# EAGLE schematic LED Cube with Rs (EAGLE 6.0)
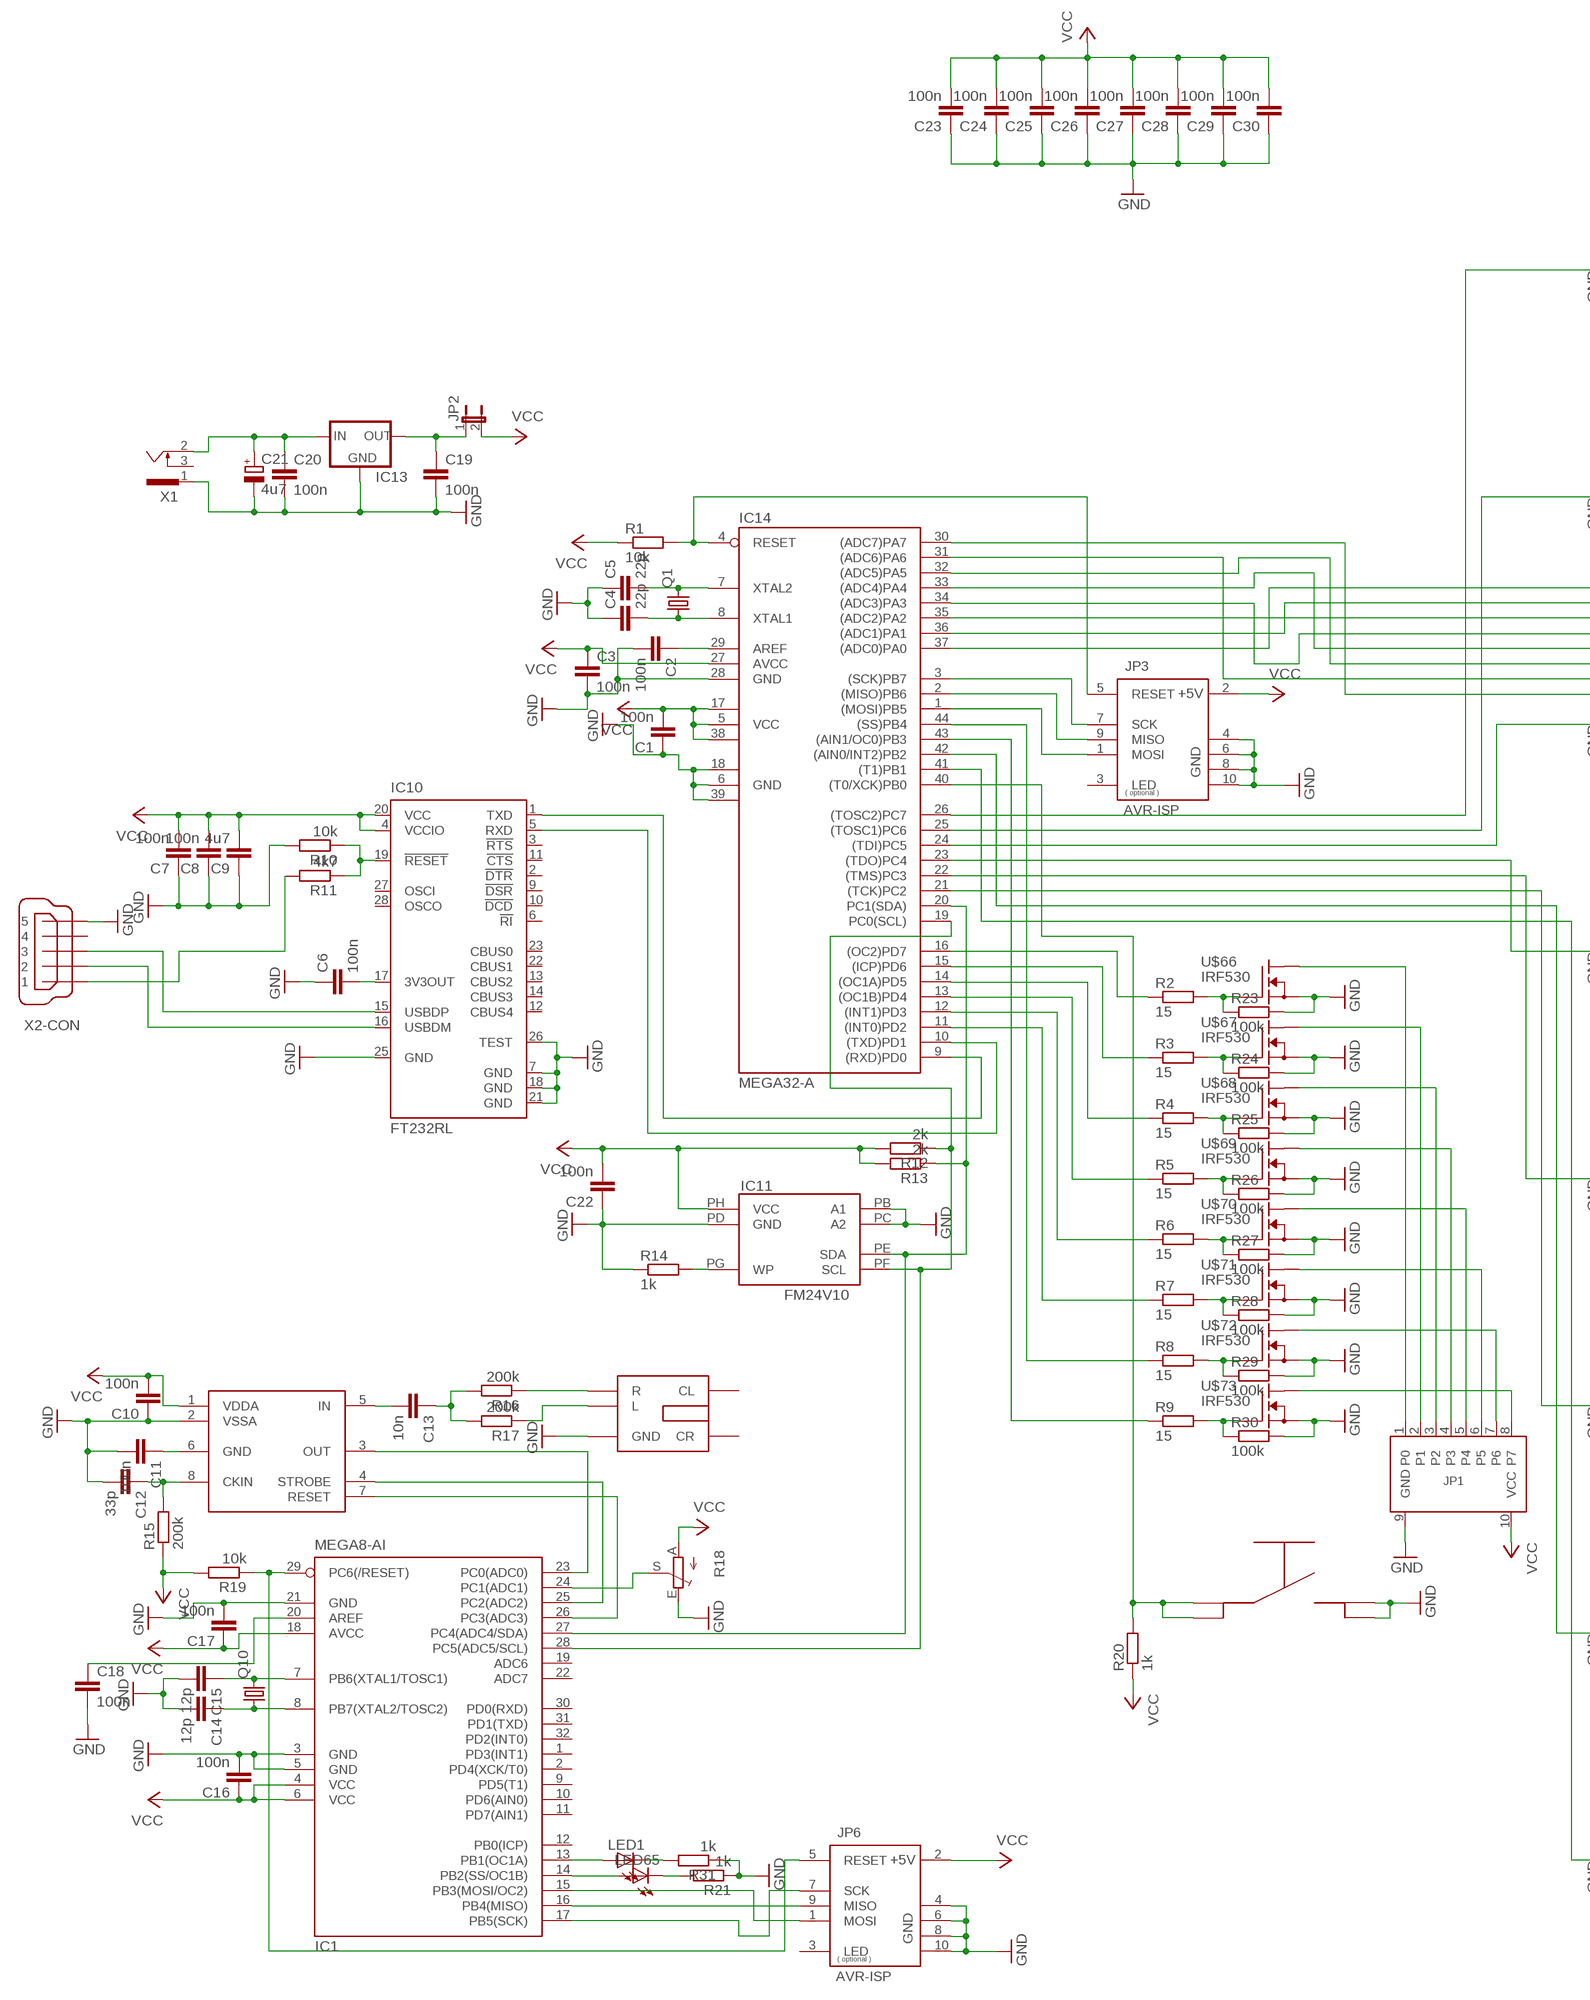
[diagram p0: schematic, sheet 1, part 1 of 2]
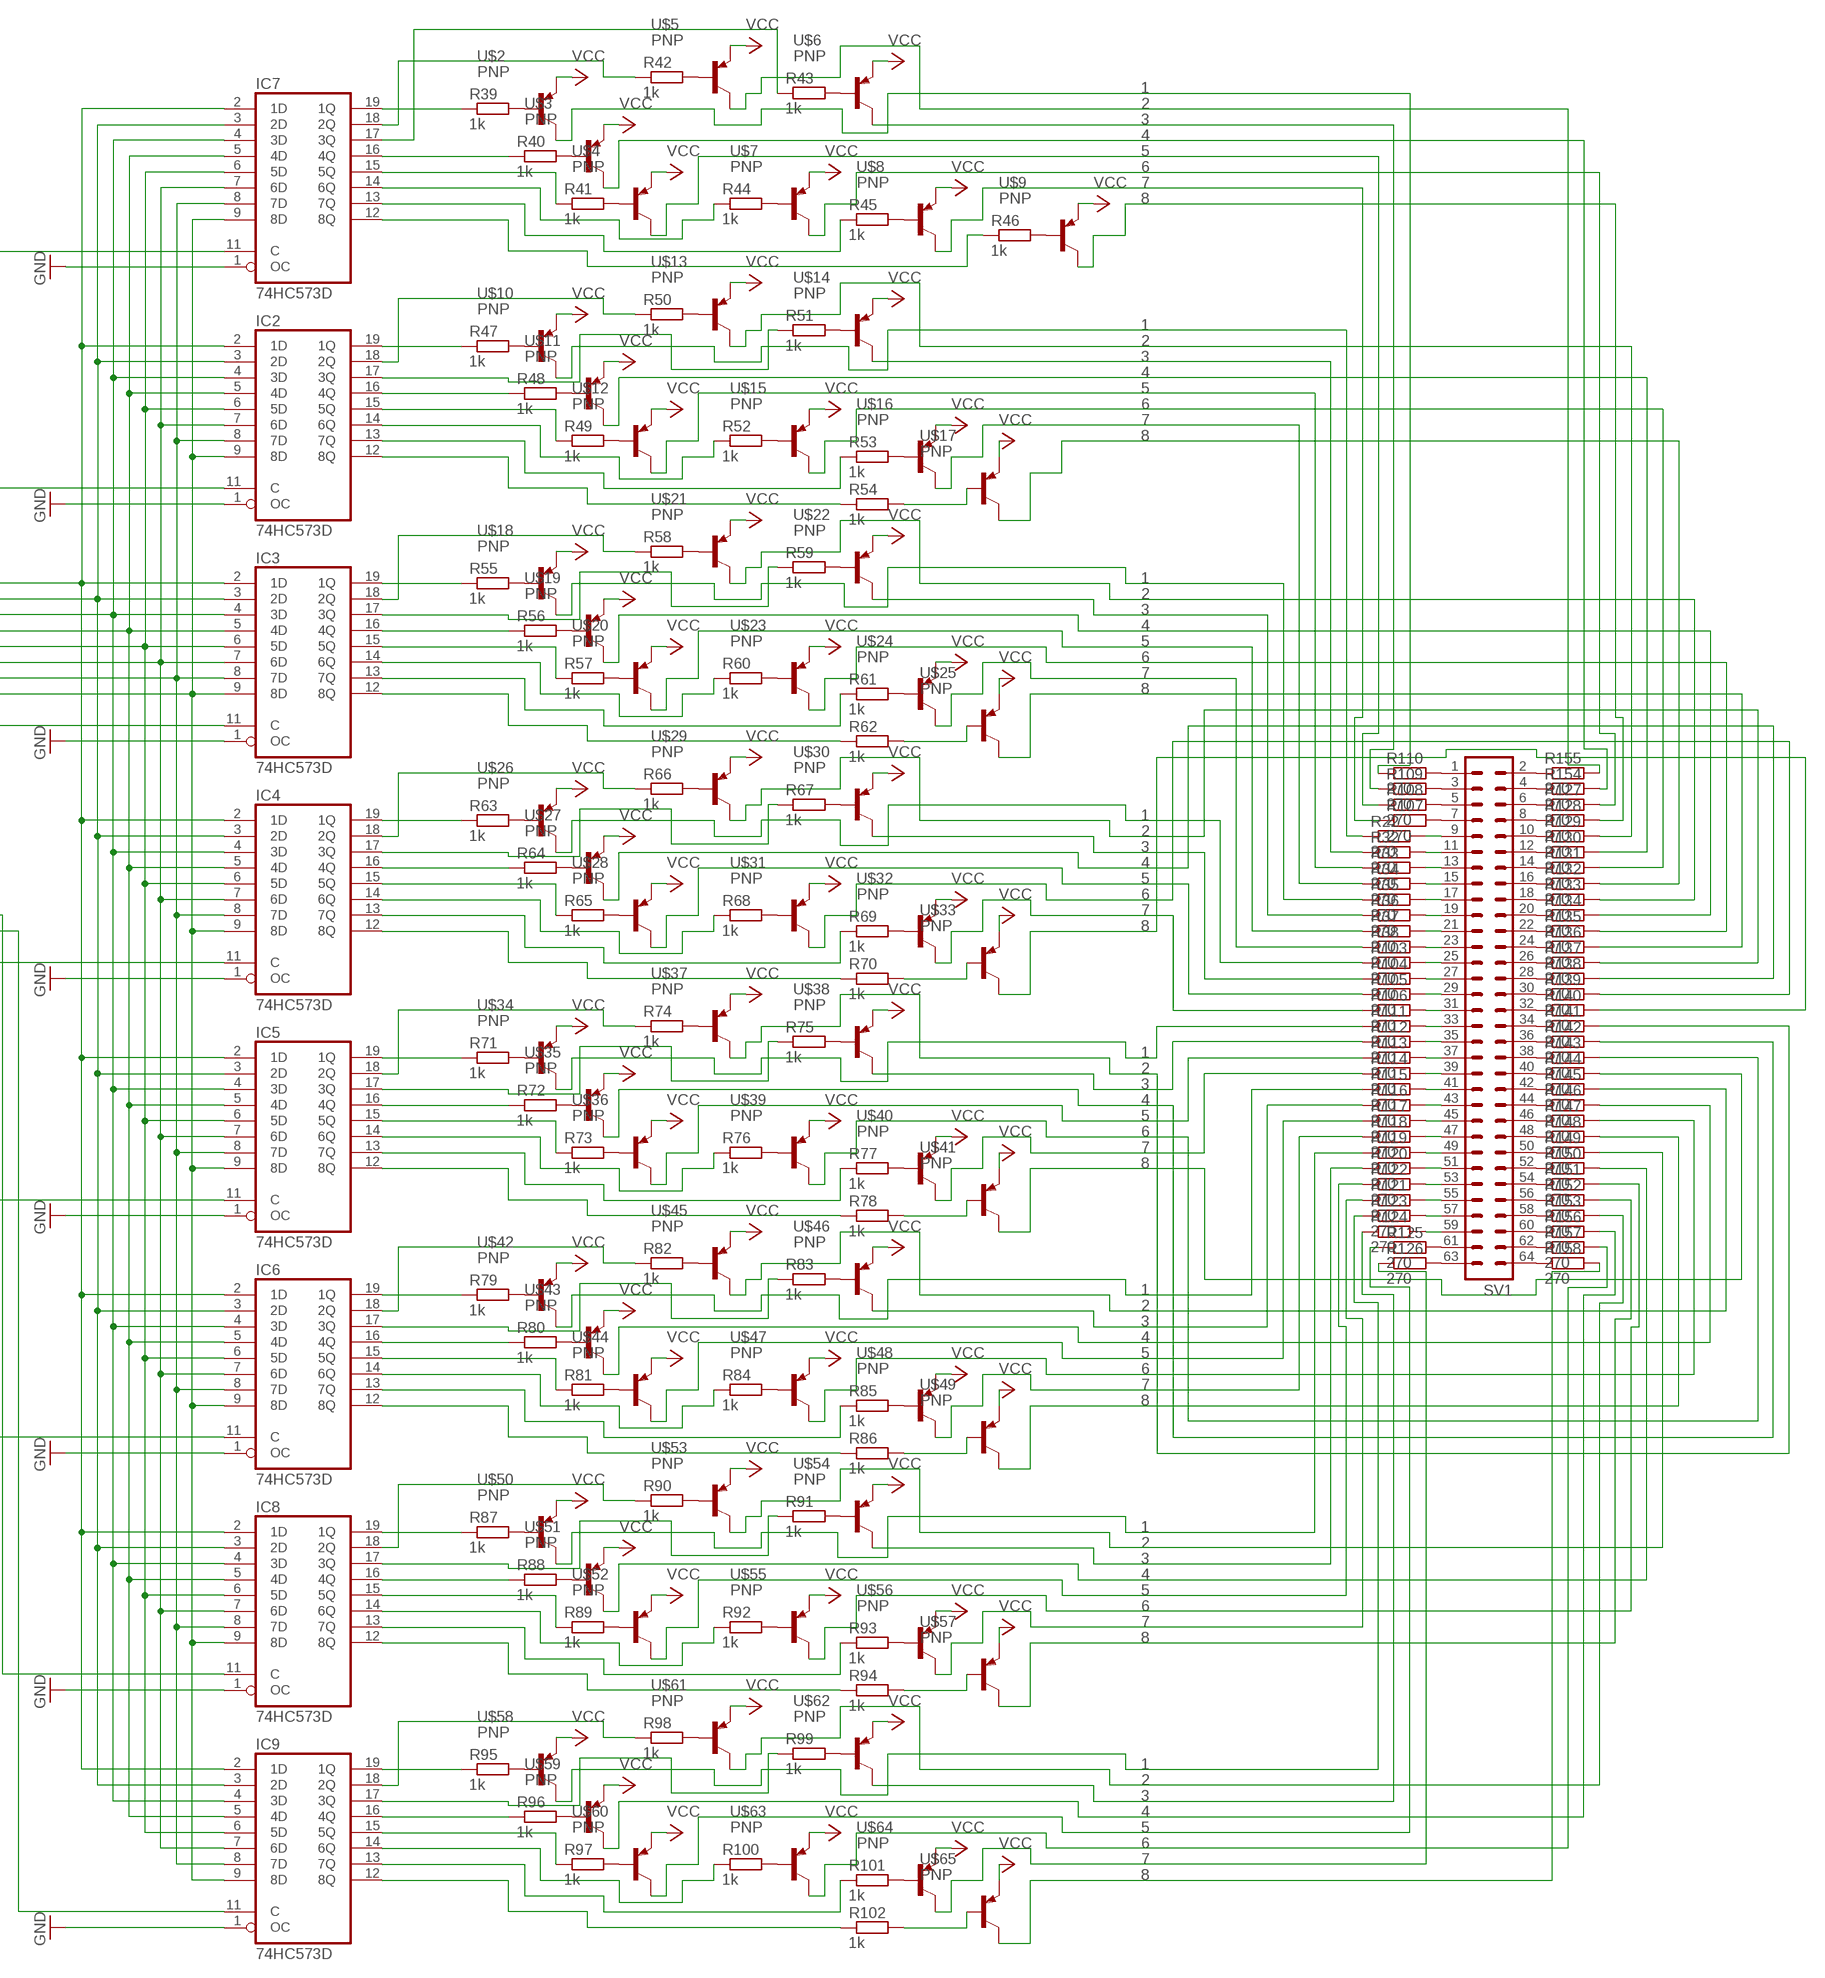
[diagram p1: schematic, sheet 1, part 2 of 2]

## Parts
C1  100n  C-EUC0603  [C0603]
C2  100n  C-EUC0603  [C0603]
C3  100n  C-EUC0603  [C0603]
C4  22p  C-EUC0603  [C0603]
C5  22p  C-EUC0603  [C0603]
C6  100n  C-EUC0603  [C0603]
C7  100n  C-EUC0603  [C0603]
C8  100n  C-EUC0603  [C0603]
C9  4u7  C-EUC0603  [C0603]
C10  100n  C-EUC0603  [C0603]
C11  100n  C-EUC0603  [C0603]
C12  33p  C-EUC0603  [C0603]
C13  10n  C-EUC0603  [C0603]
C14  12p  C-EUC0603  [C0603]
C15  12p  C-EUC0603  [C0603]
C16  100n  C-EUC0603  [C0603]
C17  100n  C-EUC0603  [C0603]
C18  100n  C-EUC0603  [C0603]
C19  100n  C-EUC0603  [C0603]
C20  100n  C-EUC0603  [C0603]
C21  4u7  CPOL-EUTAP5-80  [TAP5-80]
C22  100n  C-EUC0603  [C0603]
C23  100n  C-EUC0603  [C0603]
C24  100n  C-EUC0603  [C0603]
C25  100n  C-EUC0603  [C0603]
C26  100n  C-EUC0603  [C0603]
C27  100n  C-EUC0603  [C0603]
C28  100n  C-EUC0603  [C0603]
C29  100n  C-EUC0603  [C0603]
C30  100n  C-EUC0603  [C0603]
IC1  MEGA8-AI  [TQFP32-08]
IC2  74HC573D  [SO20W]
IC3  74HC573D  [SO20W]
IC4  74HC573D  [SO20W]
IC5  74HC573D  [SO20W]
IC6  74HC573D  [SO20W]
IC7  74HC573D  [SO20W]
IC8  74HC573D  [SO20W]
IC9  74HC573D  [SO20W]
IC10  FT232RL  [SSOP28]
IC11  FM24V10  [SOIC8]
IC12  MSGEQ7  [DIP8]
IC13  78XXS  [78XXS]
IC14  MEGA32-A  [TQFP44]
JP1  PORT  [ML10]
JP2  JP1E  [JP1]
JP3  AVR-ISP  [ML10]
JP6  AVR-ISP  [ML10]
LED1  LEDCHIPLED_0603  [CHIPLED_0603]
LED65  LEDCHIPLED_0603  [CHIPLED_0603]
Q1  CRYSTALHC49S  [HC49/S]
Q10  CRYSTALHC49S  [HC49/S]
R1  10k  R-EU_R0603  [R0603]
R2  15  R-EU_R0603  [R0603]
R3  15  R-EU_R0603  [R0603]
R4  15  R-EU_R0603  [R0603]
R5  15  R-EU_R0603  [R0603]
R6  15  R-EU_R0603  [R0603]
R7  15  R-EU_R0603  [R0603]
R8  15  R-EU_R0603  [R0603]
R9  15  R-EU_R0603  [R0603]
R10  10k  R-EU_R0603  [R0603]
R11  4k7  R-EU_R0603  [R0603]
R12  2k  R-EU_R0603  [R0603]
R13  2k  R-EU_R0603  [R0603]
R14  1k  R-EU_R0603  [R0603]
R15  200k  R-EU_R0603  [R0603]
R16  200k  R-EU_R0603  [R0603]
R17  200k  R-EU_R0603  [R0603]
R18  TRIM_EU-PT10S  [PT-10S]
R19  10k  R-EU_R0603  [R0603]
R20  1k  R-EU_R0603  [R0603]
R21  1k  R-EU_R0603  [R0603]
R22  270  R-EU_R0603  [R0603]
R23  100k  R-EU_R0603  [R0603]
R24  100k  R-EU_R0603  [R0603]
R25  100k  R-EU_R0603  [R0603]
R26  100k  R-EU_R0603  [R0603]
R27  100k  R-EU_R0603  [R0603]
R28  100k  R-EU_R0603  [R0603]
R29  100k  R-EU_R0603  [R0603]
R30  100k  R-EU_R0603  [R0603]
R31  1k  R-EU_R0603  [R0603]
R32  270  R-EU_R0603  [R0603]
R33  270  R-EU_R0603  [R0603]
R34  270  R-EU_R0603  [R0603]
R35  270  R-EU_R0603  [R0603]
R36  270  R-EU_R0603  [R0603]
R37  270  R-EU_R0603  [R0603]
R38  270  R-EU_R0603  [R0603]
R39  1k  R-EU_R0603  [R0603]
R40  1k  R-EU_R0603  [R0603]
R41  1k  R-EU_R0603  [R0603]
R42  1k  R-EU_R0603  [R0603]
R43  1k  R-EU_R0603  [R0603]
R44  1k  R-EU_R0603  [R0603]
R45  1k  R-EU_R0603  [R0603]
R46  1k  R-EU_R0603  [R0603]
R47  1k  R-EU_R0603  [R0603]
R48  1k  R-EU_R0603  [R0603]
R49  1k  R-EU_R0603  [R0603]
R50  1k  R-EU_R0603  [R0603]
R51  1k  R-EU_R0603  [R0603]
R52  1k  R-EU_R0603  [R0603]
R53  1k  R-EU_R0603  [R0603]
R54  1k  R-EU_R0603  [R0603]
R55  1k  R-EU_R0603  [R0603]
R56  1k  R-EU_R0603  [R0603]
R57  1k  R-EU_R0603  [R0603]
R58  1k  R-EU_R0603  [R0603]
R59  1k  R-EU_R0603  [R0603]
R60  1k  R-EU_R0603  [R0603]
R61  1k  R-EU_R0603  [R0603]
R62  1k  R-EU_R0603  [R0603]
R63  1k  R-EU_R0603  [R0603]
R64  1k  R-EU_R0603  [R0603]
R65  1k  R-EU_R0603  [R0603]
R66  1k  R-EU_R0603  [R0603]
R67  1k  R-EU_R0603  [R0603]
R68  1k  R-EU_R0603  [R0603]
R69  1k  R-EU_R0603  [R0603]
R70  1k  R-EU_R0603  [R0603]
R71  1k  R-EU_R0603  [R0603]
R72  1k  R-EU_R0603  [R0603]
R73  1k  R-EU_R0603  [R0603]
R74  1k  R-EU_R0603  [R0603]
R75  1k  R-EU_R0603  [R0603]
R76  1k  R-EU_R0603  [R0603]
R77  1k  R-EU_R0603  [R0603]
R78  1k  R-EU_R0603  [R0603]
R79  1k  R-EU_R0603  [R0603]
R80  1k  R-EU_R0603  [R0603]
R81  1k  R-EU_R0603  [R0603]
R82  1k  R-EU_R0603  [R0603]
R83  1k  R-EU_R0603  [R0603]
R84  1k  R-EU_R0603  [R0603]
R85  1k  R-EU_R0603  [R0603]
R86  1k  R-EU_R0603  [R0603]
R87  1k  R-EU_R0603  [R0603]
R88  1k  R-EU_R0603  [R0603]
R89  1k  R-EU_R0603  [R0603]
R90  1k  R-EU_R0603  [R0603]
R91  1k  R-EU_R0603  [R0603]
R92  1k  R-EU_R0603  [R0603]
R93  1k  R-EU_R0603  [R0603]
R94  1k  R-EU_R0603  [R0603]
R95  1k  R-EU_R0603  [R0603]
R96  1k  R-EU_R0603  [R0603]
R97  1k  R-EU_R0603  [R0603]
R98  1k  R-EU_R0603  [R0603]
R99  1k  R-EU_R0603  [R0603]
R100  1k  R-EU_R0603  [R0603]
R101  1k  R-EU_R0603  [R0603]
R102  1k  R-EU_R0603  [R0603]
R103  270  R-EU_R0603  [R0603]
R104  270  R-EU_R0603  [R0603]
R105  270  R-EU_R0603  [R0603]
R106  270  R-EU_R0603  [R0603]
R107  270  R-EU_R0603  [R0603]
R108  270  R-EU_R0603  [R0603]
R109  270  R-EU_R0603  [R0603]
R110  270  R-EU_R0603  [R0603]
R111  270  R-EU_R0603  [R0603]
R112  270  R-EU_R0603  [R0603]
R113  270  R-EU_R0603  [R0603]
R114  270  R-EU_R0603  [R0603]
R115  270  R-EU_R0603  [R0603]
R116  270  R-EU_R0603  [R0603]
R117  270  R-EU_R0603  [R0603]
R118  270  R-EU_R0603  [R0603]
R119  270  R-EU_R0603  [R0603]
R120  270  R-EU_R0603  [R0603]
R121  270  R-EU_R0603  [R0603]
R122  270  R-EU_R0603  [R0603]
R123  270  R-EU_R0603  [R0603]
R124  270  R-EU_R0603  [R0603]
R125  270  R-EU_R0603  [R0603]
R126  270  R-EU_R0603  [R0603]
R127  270  R-EU_R0603  [R0603]
R128  270  R-EU_R0603  [R0603]
R129  270  R-EU_R0603  [R0603]
R130  270  R-EU_R0603  [R0603]
R131  270  R-EU_R0603  [R0603]
R132  270  R-EU_R0603  [R0603]
R133  270  R-EU_R0603  [R0603]
R134  270  R-EU_R0603  [R0603]
R135  270  R-EU_R0603  [R0603]
R136  270  R-EU_R0603  [R0603]
R137  270  R-EU_R0603  [R0603]
R138  270  R-EU_R0603  [R0603]
R139  270  R-EU_R0603  [R0603]
R140  270  R-EU_R0603  [R0603]
R141  270  R-EU_R0603  [R0603]
R142  270  R-EU_R0603  [R0603]
R143  270  R-EU_R0603  [R0603]
R144  270  R-EU_R0603  [R0603]
R145  270  R-EU_R0603  [R0603]
R146  270  R-EU_R0603  [R0603]
R147  270  R-EU_R0603  [R0603]
R148  270  R-EU_R0603  [R0603]
R149  270  R-EU_R0603  [R0603]
R150  270  R-EU_R0603  [R0603]
R151  270  R-EU_R0603  [R0603]
R152  270  R-EU_R0603  [R0603]
R153  270  R-EU_R0603  [R0603]
R154  270  R-EU_R0603  [R0603]
R155  270  R-EU_R0603  [R0603]
R156  270  R-EU_R0603  [R0603]
R157  270  R-EU_R0603  [R0603]
R158  270  R-EU_R0603  [R0603]
SV1  ML64  [ML64]
U$1  KLINKENBUCHSE  [KLINKEPRINT]
U$2  PNP  [SOT323]
U$3  PNP  [SOT323]
U$4  PNP  [SOT323]
U$5  PNP  [SOT323]
U$6  PNP  [SOT323]
U$7  PNP  [SOT323]
U$8  PNP  [SOT323]
U$9  PNP  [SOT323]
U$10  PNP  [SOT323]
U$11  PNP  [SOT323]
U$12  PNP  [SOT323]
U$13  PNP  [SOT323]
U$14  PNP  [SOT323]
U$15  PNP  [SOT323]
U$16  PNP  [SOT323]
U$17  PNP  [SOT323]
U$18  PNP  [SOT323]
U$19  PNP  [SOT323]
U$20  PNP  [SOT323]
U$21  PNP  [SOT323]
U$22  PNP  [SOT323]
U$23  PNP  [SOT323]
U$24  PNP  [SOT323]
U$25  PNP  [SOT323]
U$26  PNP  [SOT323]
U$27  PNP  [SOT323]
U$28  PNP  [SOT323]
U$29  PNP  [SOT323]
U$30  PNP  [SOT323]
U$31  PNP  [SOT323]
U$32  PNP  [SOT323]
U$33  PNP  [SOT323]
U$34  PNP  [SOT323]
U$35  PNP  [SOT323]
U$36  PNP  [SOT323]
U$37  PNP  [SOT323]
U$38  PNP  [SOT323]
U$39  PNP  [SOT323]
U$40  PNP  [SOT323]
U$41  PNP  [SOT323]
U$42  PNP  [SOT323]
U$43  PNP  [SOT323]
U$44  PNP  [SOT323]
U$45  PNP  [SOT323]
U$46  PNP  [SOT323]
U$47  PNP  [SOT323]
U$48  PNP  [SOT323]
U$49  PNP  [SOT323]
U$50  PNP  [SOT323]
U$51  PNP  [SOT323]
U$52  PNP  [SOT323]
U$53  PNP  [SOT323]
U$54  PNP  [SOT323]
U$55  PNP  [SOT323]
U$56  PNP  [SOT323]
U$57  PNP  [SOT323]
U$58  PNP  [SOT323]
U$59  PNP  [SOT323]
U$60  PNP  [SOT323]
U$61  PNP  [SOT323]
U$62  PNP  [SOT323]
U$63  PNP  [SOT323]
U$64  PNP  [SOT323]
U$65  PNP  [SOT323]
U$66  IRF530  [TO220-3V]
U$67  IRF530  [TO220-3V]
U$68  IRF530  [TO220-3V]
U$69  IRF530  [TO220-3V]
U$70  IRF530  [TO220-3V]
U$71  IRF530  [TO220-3V]
U$72  IRF530  [TO220-3V]
U$73  IRF530  [TO220-3V]
U$74  TASTER  [SMDTASTER]
X1  733980-62  [733980-62]
X2  USB-B-MINI-SMD  [USB-B-MINI-SMD]

## Nets
GND: C1.1 C2.2 C3.2 C4.1 C5.1 C6.1 C7.1 C8.1 C9.1 C10.1 C11.2 C12.2 C14.2 C15.2 C16.2 C17.2 C18.2 C19.2 C20.2 C21.- C22.1 C23.1 C24.1 C25.1 C26.1 C27.1 C28.1 C29.1 C30.1 IC1.3(GND) IC1.5(GND) IC1.21(GND) IC2.1(OC) IC3.1(OC) IC4.1(OC) IC5.1(OC) IC6.1(OC) IC7.1(OC) IC8.1(OC) IC9.1(OC) IC10.7(GND) IC10.18(GND) IC10.21(GND) IC10.25(GND) IC10.26(TEST) IC11.PB(A1) IC11.PC(A2) IC11.PD(GND) IC12.2(VSSA) IC13.GND IC14.6(GND) IC14.18(GND1) IC14.28(GND) IC14.39(GND2) JP1.9(GND) JP3.4(GND) JP3.6(GND) JP3.8(GND) JP3.10(GND) JP6.4(GND) JP6.6(GND) JP6.8(GND) JP6.10(GND) R10.2 R14.1 R18.E R21.1 R23.2 R24.2 R25.2 R26.2 R27.2 R28.2 R29.2 R30.2 R31.1 U$1.GND U$66.3(S) U$67.3(S) U$68.3(S) U$69.3(S) U$70.3(S) U$71.3(S) U$72.3(S) U$73.3(S) U$74.B U$74.B2 X1.1 X2.5
N$1: R154.2 U$3.P$3(C)
N$2: IC14.4(RESET) JP3.5(RESET) R1.2
N$3: C2.1 IC14.29(AREF)
N$4: IC2.2(1D) IC3.2(1D) IC4.2(1D) IC5.2(1D) IC6.2(1D) IC7.2(1D) IC8.2(1D) IC9.2(1D) IC14.37((ADC0)PA0)
N$5: IC2.3(2D) IC3.3(2D) IC4.3(2D) IC5.3(2D) IC6.3(2D) IC7.3(2D) IC8.3(2D) IC9.3(2D) IC14.36((ADC1)PA1)
N$6: IC2.4(3D) IC3.4(3D) IC4.4(3D) IC5.4(3D) IC6.4(3D) IC7.4(3D) IC8.4(3D) IC9.4(3D) IC14.35((ADC2)PA2)
N$7: C5.2 IC14.7(XTAL2) Q1.2
N$8: C4.2 IC14.8(XTAL1) Q1.1
N$9: IC2.5(4D) IC3.5(4D) IC4.5(4D) IC5.5(4D) IC6.5(4D) IC7.5(4D) IC8.5(4D) IC9.5(4D) IC14.34((ADC3)PA3)
N$10: IC2.6(5D) IC3.6(5D) IC4.6(5D) IC5.6(5D) IC6.6(5D) IC7.6(5D) IC8.6(5D) IC9.6(5D) IC14.33((ADC4)PA4)
N$11: IC2.7(6D) IC3.7(6D) IC4.7(6D) IC5.7(6D) IC6.7(6D) IC7.7(6D) IC8.7(6D) IC9.7(6D) IC14.32((ADC5)PA5)
N$12: IC2.8(7D) IC3.8(7D) IC4.8(7D) IC5.8(7D) IC6.8(7D) IC7.8(7D) IC8.8(7D) IC9.8(7D) IC14.31((ADC6)PA6)
N$13: IC2.9(8D) IC3.9(8D) IC4.9(8D) IC5.9(8D) IC6.9(8D) IC7.9(8D) IC8.9(8D) IC9.9(8D) IC14.30((ADC7)PA7)
N$14: IC9.11(C) IC14.41((T1)PB1)
N$15: IC8.11(C) IC14.42((AIN0/INT2)PB2)
N$16: IC6.11(C) IC14.21((TCK)PC2)
N$17: IC5.11(C) IC14.22((TMS)PC3)
N$18: IC4.11(C) IC14.23((TDO)PC4)
N$19: IC3.11(C) IC14.24((TDI)PC5)
N$20: IC2.11(C) IC14.25((TOSC1)PC6)
N$21: IC7.11(C) IC14.26((TOSC2)PC7)
N$22: R2.2 R23.1 U$66.1(G)
N$23: IC14.16((OC2)PD7) R2.1
N$24: IC14.15((ICP)PD6) R3.1
N$25: IC14.14((OC1A)PD5) R4.1
N$26: IC14.13((OC1B)PD4) R5.1
N$27: IC14.12((INT1)PD3) R6.1
N$28: IC14.11((INT0)PD2) R7.1
N$29: IC14.44((SS)PB4) R8.1
N$30: IC14.43((AIN1/OC0)PB3) R9.1
N$31: R3.2 R24.1 U$67.1(G)
N$32: R4.2 R25.1 U$68.1(G)
N$33: R5.2 R26.1 U$69.1(G)
N$34: R6.2 R27.1 U$70.1(G)
N$35: R7.2 R28.1 U$71.1(G)
N$36: R8.2 R29.1 U$72.1(G)
N$37: R9.2 R30.1 U$73.1(G)
N$38: JP1.1(P0) U$66.2(D)
N$39: JP1.2(P1) U$67.2(D)
N$40: R106.2 SV1.31
N$41: R105.2 SV1.29
N$42: JP1.5(P4) U$70.2(D)
N$43: JP1.6(P5) U$71.2(D)
N$44: JP1.7(P6) U$72.2(D)
N$45: JP1.8(P7) U$73.2(D)
N$46: R11.2 X2.1
N$47: IC14.3((SCK)PB7) JP3.7(SCK)
N$48: IC14.2((MISO)PB6) JP3.9(MISO)
N$49: IC14.1((MOSI)PB5) JP3.1(MOSI)
N$50: IC10.5(RXD) IC14.10((TXD)PD1)
N$51: IC10.1(TXD) IC14.9((RXD)PD0)
N$52: IC10.19(!RESET) R10.1 R11.1
N$53: IC1.27(PC4(ADC4/SDA)) IC11.PE(SDA) IC14.20(PC1(SDA)) R13.1
N$54: IC10.15(USBDP) X2.3
N$55: C6.2 IC10.17(3V3OUT)
N$56: IC10.16(USBDM) X2.2
N$57: IC1.28(PC5(ADC5/SCL)) IC11.PF(SCL) IC14.19(PC0(SCL)) R12.1
N$58: IC11.PG(WP) R14.2
N$59: C12.1 IC12.8(CKIN) R15.2
N$60: C11.1 IC12.6(GND)
N$61: C13.2 IC12.5(IN)
N$62: C13.1 R16.2 R17.2
N$63: R16.1 U$1.RIGHT(R)
N$64: R17.1 U$1.LEFT(L)
N$65: IC1.23(PC0(ADC0)) IC12.3(OUT)
N$66: IC1.29(PC6(/RESET)) JP6.5(RESET) R19.1
N$67: IC1.25(PC2(ADC2)) IC12.4(STROBE)
N$68: IC1.26(PC3(ADC3)) IC12.7(RESET)
N$69: IC14.40((T0/XCK)PB0) R20.2 U$74.A U$74.A2
N$70: C14.1 IC1.8(PB7(XTAL2/TOSC2)) Q10.1
N$71: C15.1 IC1.7(PB6(XTAL1/TOSC1)) Q10.2
N$72: R104.2 SV1.27
N$73: R103.2 SV1.25
N$74: C20.1 C21.+ IC13.IN X1.2
N$75: IC1.14(PB2(SS/OC1B)) LED65.A
N$76: LED65.C R21.2
N$77: IC1.24(PC1(ADC1)) R18.S
N$78: C18.1 IC1.20(AREF)
N$79: IC1.16(PB4(MISO)) JP6.9(MISO)
N$80: IC1.15(PB3(MOSI/OC2)) JP6.1(MOSI)
N$81: IC1.17(PB5(SCK)) JP6.7(SCK)
N$82: LED1.C R31.2
N$83: IC1.13(PB1(OC1A)) LED1.A
N$84: C19.1 IC13.OUT JP2.1
N$85: R38.2 SV1.23
N$86: R37.2 SV1.21
N$87: R36.2 SV1.19
N$88: R35.2 SV1.17
N$89: R34.2 SV1.15
N$90: R33.2 SV1.13
N$91: R32.2 SV1.11
N$92: R22.2 SV1.9
N$93: R107.2 SV1.7
N$94: R108.2 SV1.5
N$95: R123.2 SV1.57
N$96: R109.2 SV1.3
N$97: R110.2 SV1.1
N$98: R155.2 U$5.P$3(C)
N$99: R109.1 U$6.P$3(C)
N$100: R108.1 U$4.P$3(C)
N$101: R44.2 U$7.P$1(B)
N$102: R127.2 U$7.P$3(C)
N$103: R42.2 U$5.P$1(B)
N$104: R128.2 U$9.P$3(C)
N$105: R132.2 U$17.P$3(C)
N$106: R63.2 U$26.P$1(B)
N$107: R64.2 U$27.P$1(B)
N$108: R65.2 U$28.P$1(B)
N$109: R130.2 U$11.P$3(C)
N$110: R129.2 U$13.P$3(C)
N$111: R22.1 U$10.P$3(C)
N$112: R54.2 U$17.P$1(B)
N$113: IC4.19(1Q) R63.1
N$114: IC4.16(4Q) R64.1
N$115: R66.2 U$29.P$1(B)
N$116: IC4.18(2Q) R66.1
N$117: R67.2 U$30.P$1(B)
N$118: IC4.17(3Q) R67.1
N$119: IC4.15(5Q) R65.1
N$120: R68.2 U$31.P$1(B)
N$121: R71.2 U$34.P$1(B)
N$122: R72.2 U$35.P$1(B)
N$123: R73.2 U$36.P$1(B)
N$124: IC5.19(1Q) R71.1
N$125: IC5.16(4Q) R72.1
N$126: R74.2 U$37.P$1(B)
N$127: IC5.18(2Q) R74.1
N$128: R75.2 U$38.P$1(B)
N$129: IC7.19(1Q) R39.1
N$130: R126.1 U$64.P$3(C)
N$131: R125.1 U$60.P$3(C)
N$132: IC7.16(4Q) R40.1
N$133: IC2.19(1Q) R47.1
N$134: R157.2 U$63.P$3(C)
N$135: IC2.16(4Q) R48.1
N$136: R153.2 U$61.P$3(C)
N$137: R95.2 U$58.P$1(B)
N$138: R121.1 U$56.P$3(C)
N$139: R96.2 U$59.P$1(B)
N$140: R97.2 U$60.P$1(B)
N$141: IC9.19(1Q) R95.1
N$142: R151.2 U$55.P$3(C)
N$143: IC9.16(4Q) R96.1
N$144: R149.2 U$53.P$3(C)
N$145: R87.2 U$50.P$1(B)
N$146: R88.2 U$51.P$1(B)
N$147: R89.2 U$52.P$1(B)
N$148: IC8.16(4Q) R88.1
N$149: IC8.19(1Q) R87.1
N$150: R90.2 U$53.P$1(B)
N$151: IC8.18(2Q) R90.1
N$152: R91.2 U$54.P$1(B)
N$153: R79.2 U$42.P$1(B)
N$154: R80.2 U$43.P$1(B)
N$155: R81.2 U$44.P$1(B)
N$156: IC6.19(1Q) R79.1
N$157: IC6.16(4Q) R80.1
N$158: R82.2 U$45.P$1(B)
N$159: IC6.18(2Q) R82.1
N$160: R83.2 U$46.P$1(B)
N$161: R40.2 U$3.P$1(B)
N$162: R39.2 U$2.P$1(B)
N$163: IC7.15(5Q) R41.1
N$164: R110.1 U$2.P$3(C)
N$165: R41.2 U$4.P$1(B)
N$166: R107.1 U$8.P$3(C)
N$167: IC3.19(1Q) R55.1
N$168: IC3.16(4Q) R56.1
N$169: R47.2 U$10.P$1(B)
N$170: IC7.14(6Q) R44.1
N$171: R45.2 U$8.P$1(B)
N$172: IC7.18(2Q) R42.1
N$173: R43.2 U$6.P$1(B)
N$174: R48.2 U$11.P$1(B)
N$175: IC7.17(3Q) R43.1
N$176: IC7.13(7Q) R45.1
N$177: R46.2 U$9.P$1(B)
N$178: R49.2 U$12.P$1(B)
N$179: IC7.12(8Q) R46.1
N$180: R35.1 U$18.P$3(C)
N$181: R103.1 U$26.P$3(C)
N$182: IC4.14(6Q) R68.1
N$183: R33.1 U$12.P$3(C)
N$184: R50.2 U$13.P$1(B)
N$185: IC2.18(2Q) R50.1
N$186: R51.2 U$14.P$1(B)
N$187: IC2.17(3Q) R51.1
N$188: R32.1 U$14.P$3(C)
N$189: IC2.15(5Q) R49.1
N$190: R69.2 U$32.P$1(B)
N$191: IC4.13(7Q) R69.1
N$192: R52.2 U$15.P$1(B)
N$193: IC2.14(6Q) R52.1
N$194: R131.2 U$15.P$3(C)
N$195: R53.2 U$16.P$1(B)
N$196: IC2.13(7Q) R53.1
N$197: R34.1 U$16.P$3(C)
N$198: IC4.12(8Q) R70.1
N$199: R140.2 U$33.P$3(C)
N$200: IC2.12(8Q) R54.1
N$201: R55.2 U$18.P$1(B)
N$202: R56.2 U$19.P$1(B)
N$203: R57.2 U$20.P$1(B)
N$204: R111.1 U$34.P$3(C)
N$205: R115.1 U$42.P$3(C)
N$206: R58.2 U$21.P$1(B)
N$207: IC3.18(2Q) R58.1
N$208: R59.2 U$22.P$1(B)
N$209: IC3.17(3Q) R59.1
N$210: IC3.15(5Q) R57.1
N$211: R60.2 U$23.P$1(B)
N$212: IC3.14(6Q) R60.1
N$213: R61.2 U$24.P$1(B)
N$214: IC3.13(7Q) R61.1
N$215: IC3.12(8Q) R62.1
N$216: R136.2 U$25.P$3(C)
N$217: R38.1 U$24.P$3(C)
N$218: R135.2 U$23.P$3(C)
N$219: R37.1 U$20.P$3(C)
N$220: R134.2 U$19.P$3(C)
N$221: R133.2 U$21.P$3(C)
N$222: R119.1 U$50.P$3(C)
N$223: R62.2 U$25.P$1(B)
N$224: R36.1 U$22.P$3(C)
N$225: R106.1 U$32.P$3(C)
N$226: R139.2 U$31.P$3(C)
N$227: R105.1 U$28.P$3(C)
N$228: R138.2 U$27.P$3(C)
N$229: R137.2 U$29.P$3(C)
N$230: R123.1 U$58.P$3(C)
N$231: R70.2 U$33.P$1(B)
N$232: R104.1 U$30.P$3(C)
N$233: IC5.17(3Q) R75.1
N$234: IC5.15(5Q) R73.1
N$235: R76.2 U$39.P$1(B)
N$236: IC5.14(6Q) R76.1
N$237: R77.2 U$40.P$1(B)
N$238: IC5.13(7Q) R77.1
N$239: IC5.12(8Q) R78.1
N$240: R144.2 U$41.P$3(C)
N$241: R114.1 U$40.P$3(C)
N$242: R143.2 U$39.P$3(C)
N$243: R113.1 U$36.P$3(C)
N$244: R142.2 U$35.P$3(C)
N$245: R141.2 U$37.P$3(C)
N$246: R111.2 SV1.33
N$247: R78.2 U$41.P$1(B)
N$248: R112.1 U$38.P$3(C)
N$249: IC6.17(3Q) R83.1
N$250: IC6.15(5Q) R81.1
N$251: R84.2 U$47.P$1(B)
N$252: IC6.14(6Q) R84.1
N$253: R85.2 U$48.P$1(B)
N$254: IC6.13(7Q) R85.1
N$255: IC6.12(8Q) R86.1
N$256: R148.2 U$49.P$3(C)
N$257: R118.1 U$48.P$3(C)
N$258: R147.2 U$47.P$3(C)
N$259: R117.1 U$44.P$3(C)
N$260: R146.2 U$43.P$3(C)
N$261: R145.2 U$45.P$3(C)
N$262: R112.2 SV1.35
N$263: R86.2 U$49.P$1(B)
N$264: R116.1 U$46.P$3(C)
N$265: IC8.17(3Q) R91.1
N$266: IC8.15(5Q) R89.1
N$267: R92.2 U$55.P$1(B)
N$268: IC8.14(6Q) R92.1
N$269: R93.2 U$56.P$1(B)
N$270: IC8.13(7Q) R93.1
N$271: IC8.12(8Q) R94.1
N$272: R152.2 U$57.P$3(C)
N$273: R98.2 U$61.P$1(B)
N$274: IC9.18(2Q) R98.1
N$275: R122.1 U$52.P$3(C)
N$276: R150.2 U$51.P$3(C)
N$277: R99.2 U$62.P$1(B)
N$278: JP1.3(P2) U$68.2(D)
N$279: R94.2 U$57.P$1(B)
N$280: R120.1 U$54.P$3(C)
N$281: IC9.17(3Q) R99.1
N$282: IC9.15(5Q) R97.1
N$283: R100.2 U$63.P$1(B)
N$284: IC9.14(6Q) R100.1
N$285: R101.2 U$64.P$1(B)
N$286: IC9.13(7Q) R101.1
N$287: IC9.12(8Q) R102.1
N$288: R158.2 U$65.P$3(C)
N$289: JP1.4(P3) U$69.2(D)
N$290: R113.2 SV1.37
N$291: R114.2 SV1.39
N$292: R156.2 U$59.P$3(C)
N$293: R115.2 SV1.41
N$294: R116.2 SV1.43
N$295: R102.2 U$65.P$1(B)
N$296: R124.1 U$62.P$3(C)
N$297: R117.2 SV1.45
N$298: R118.2 SV1.47
N$299: R119.2 SV1.49
N$300: R120.2 SV1.51
N$301: R122.2 SV1.53
N$302: R121.2 SV1.55
N$303: R124.2 SV1.59
N$304: R125.2 SV1.61
N$305: R126.2 SV1.63
N$306: R127.1 SV1.6
N$307: R128.1 SV1.8
N$308: R129.1 SV1.10
N$309: R130.1 SV1.12
N$310: R131.1 SV1.14
N$311: R132.1 SV1.16
N$312: R133.1 SV1.18
N$313: R134.1 SV1.20
N$314: R135.1 SV1.22
N$315: R136.1 SV1.24
N$316: R137.1 SV1.26
N$317: R138.1 SV1.28
N$318: R139.1 SV1.30
N$319: R140.1 SV1.32
N$320: R141.1 SV1.34
N$321: R142.1 SV1.36
N$322: R143.1 SV1.38
N$323: R144.1 SV1.40
N$324: R145.1 SV1.42
N$325: R146.1 SV1.44
N$326: R147.1 SV1.46
N$327: R148.1 SV1.48
N$328: R149.1 SV1.50
N$329: R150.1 SV1.52
N$330: R151.1 SV1.54
N$331: R152.1 SV1.56
N$332: R153.1 SV1.58
N$333: R154.1 SV1.4
N$334: R155.1 SV1.2
N$335: R156.1 SV1.60
N$336: R157.1 SV1.62
N$337: R158.1 SV1.64
VCC: C1.2 C3.1 C7.2 C8.2 C9.2 C10.2 C16.1 C17.1 C22.2 C23.2 C24.2 C25.2 C26.2 C27.2 C28.2 C29.2 C30.2 IC1.4(VCC) IC1.6(VCC) IC1.18(AVCC) IC10.4(VCCIO) IC10.20(VCC) IC11.PH(VCC) IC12.1(VDDA) IC14.5(VCC) IC14.17(VCC1) IC14.27(AVCC) IC14.38(VCC2) JP1.10(VCC) JP2.2 JP3.2(+5V) JP6.2(+5V) R1.1 R12.2 R13.2 R15.1 R18.A R19.2 R20.1 U$2.P$2(E) U$3.P$2(E) U$4.P$2(E) U$5.P$2(E) U$6.P$2(E) U$7.P$2(E) U$8.P$2(E) U$9.P$2(E) U$10.P$2(E) U$11.P$2(E) U$12.P$2(E) U$13.P$2(E) U$14.P$2(E) U$15.P$2(E) U$16.P$2(E) U$17.P$2(E) U$18.P$2(E) U$19.P$2(E) U$20.P$2(E) U$21.P$2(E) U$22.P$2(E) U$23.P$2(E) U$24.P$2(E) U$25.P$2(E) U$26.P$2(E) U$27.P$2(E) U$28.P$2(E) U$29.P$2(E) U$30.P$2(E) U$31.P$2(E) U$32.P$2(E) U$33.P$2(E) U$34.P$2(E) U$35.P$2(E) U$36.P$2(E) U$37.P$2(E) U$38.P$2(E) U$39.P$2(E) U$40.P$2(E) U$41.P$2(E) U$42.P$2(E) U$43.P$2(E) U$44.P$2(E) U$45.P$2(E) U$46.P$2(E) U$47.P$2(E) U$48.P$2(E) U$49.P$2(E) U$50.P$2(E) U$51.P$2(E) U$52.P$2(E) U$53.P$2(E) U$54.P$2(E) U$55.P$2(E) U$56.P$2(E) U$57.P$2(E) U$58.P$2(E) U$59.P$2(E) U$60.P$2(E) U$61.P$2(E) U$62.P$2(E) U$63.P$2(E) U$64.P$2(E) U$65.P$2(E)
Unconnected: IC1.1(PD3(INT1)) IC1.2(PD4(XCK/T0)) IC1.9(PD5(T1)) IC1.10(PD6(AIN0)) IC1.11(PD7(AIN1)) IC1.12(PB0(ICP)) IC1.19(ADC6) IC1.22(ADC7) IC1.30(PD0(RXD)) IC1.31(PD1(TXD)) IC1.32(PD2(INT0)) IC10.2(!DTR) IC10.3(!RTS) IC10.6(!RI) IC10.9(!DSR) IC10.10(!DCD) IC10.11(!CTS) IC10.12(CBUS4) IC10.13(CBUS2) IC10.14(CBUS3) IC10.22(CBUS1) IC10.23(CBUS0) IC10.27(OSCI) IC10.28(OSCO) JP3.3(LED) JP6.3(LED) U$1.CONLEFT(CL) U$1.CONRIGHT(CR) X1.3 X2.4 X2.M1(-SHIELD:S1) X2.M2(-SHIELD:S2) X2.M3(-SHIELD:S3) X2.M4(-SHIELD:S4)

## Notes on the sheet
- 1
- 2
- 3
- 4
- 5
- 6
- 7
- 8
- 1
- 2
- 3
- 4
- 5
- 6
- 7
- 8
- 1
- 2
- 3
- 4
- 5
- 6
- 7
- 8
- 1
- 2
- 3
- 4
- 5
- 6
- 7
- 8
- 1
- 2
- 3
- 4
- 5
- 6
- 7
- 8
- 1
- 2
- 3
- 4
- 5
- 6
- 7
- 8
- 1
- 2
- 3
- 4
- 5
- 6
- 7
- 8
- 1
- 2
- 3
- 4
- 5
- 6
- 7
- 8

## Power pins joined to a net without a drawn wire
GND: IC2.10(GND) IC3.10(GND) IC4.10(GND) IC5.10(GND) IC6.10(GND) IC7.10(GND) IC8.10(GND) IC9.10(GND)
VCC: IC2.20(VCC) IC3.20(VCC) IC4.20(VCC) IC5.20(VCC) IC6.20(VCC) IC7.20(VCC) IC8.20(VCC) IC9.20(VCC)

## Library data of the parts
C1-C20 C22-C30 = resistor:C-EU: CAPACITOR, European symbol
C21 = resistor:CPOL-EU: POLARIZED CAPACITOR, European symbol
IC1 = atmel:MEGA8: MICROCONTROLLER 8 Kbytes FLASH, 1 kbytes SRAM, 512 bytes EEPROM, USART, 6-channel 10 bit ADC, 2-channel 8 bit ADC Pin compatible with Atmega48, ATMega88, ATMega168 Source: avr.lbr; MPN: ATMEGA8-16AU; OC_FARNELL: 9171371; OC_NEWARK: 73M8863
IC2-IC9 = 74xx-eu:74*573: 8-bit D latch BUS DRIVER
IC10 = ftdichip:FT232R: Source: http://www.ftdichip.com/Documents/DataSheets/DS_FT232R_v104.pdf; MPN: FT232RL; OC_FARNELL: 1146032; OC_NEWARK: 91K9918
IC11 = 0-xythobuz:FM24V10
IC12 = 0-xythobuz:MSGEQ7
IC13 = v-reg:78XXS: VOLTAGE REGULATOR
IC14 = atmel:MEGA32: MICROCONTROLLER 32 Kbytes FLASH 2 Kbytes SRAM 1 Kbytes EEPROM USART 8-channel 10 bit ADC Source: www.atmel.com .. doc2503.pdf; MPN: ATMEGA32-16AU; OC_FARNELL: 9171274; OC_NEWARK: 69K6677
JP1 = 0-roboternetz-definitionen:PORT: Datenportstecker Kompatibel zu den Steckern des STK500
JP2 = jumper:JP1E: JUMPER
JP3 JP6 = 0-roboternetz-definitionen:AVR-ISP: ISP ( In System Programming ) Stecker für AVRs Über diesen Anschluß kann ein AVR mit einem Standard ISP-Kabel direkt an einen Parallelport des PC´s angeschlossen und programmiert werden. Die Belegung des ISP-Anschlusses ist zu dem weit verbreitetet STK200 Programmier Dongle kompatibel. Ein entsprechender Dongle ist über zahlreiche Händler lieferbar. Es gibt aber auch viele Selbstbauanleitungen im Internet.
LED1 LED65 = led:LED: LED OSRAM: - CHIPLED LG R971, LG N971, LY N971, LG Q971, LY Q971, LO R971, LY R971 LH N974, LH R974 LS Q976, LO Q976, LY Q976 LO Q996 - Hyper CHIPLED LW Q18S LB Q993, LB Q99A, LB R99A - SideLED LS A670, LO A670, LY A670, LG A670, LP A670 LB A673, LV A673, LT A673, LW A673 LH A674 LY A675 LS A676, LA A676, LO A676, LY A676, LW A676 LS A679, LY A679, LG A679 - Hyper Micro SIDELED® LS Y876, LA Y876, LO Y876, LY Y876 LT Y87S - SmartLED LW L88C, LW L88S LB L89C, LB L89S, LG L890 LS L89K, LO L89K, LY L89K LS L896, LA L896, LO L896, LY L896 - TOPLED LS T670, LO T670, LY T670, LG T670, LP T670 LSG T670, LSP T670, LSY T670, LOP T670, LYG T670 LG T671, LOG T671, LSG T671 LB T673, LV T673, LT T673, LW T673 LH T674 LS T676, LA T676, LO T676, LY T676, LB T676, LH T676, LSB T676, LW T676 LB T67C, LV T67C, LT T67C, LS T67K, LO T67K, LY T67K, LW E67C LS E67B, LA E67B, LO E67B, LY E67B, LB E67C, LV E67C, LT E67C LW T67C LS T679, LY T679, LG T679 LS T770, LO T770, LY T770, LG T770, LP T770 LB T773, LV T773, LT T773, LW T773 LH T774 LS E675, LA E675, LY E675, LS T675 LS T776, LA T776, LO T776, LY T776, LB T776 LHGB T686 LT T68C, LB T68C - Hyper Mini TOPLED® LB M676 - Mini TOPLED Santana® LG M470 LS M47K, LO M47K, LY M47K Source: http://www.osram.convergy.de LUXEON: - LUMILED® LXK2-PW12-R00, LXK2-PW12-S00, LXK2-PW14-U00, LXK2-PW14-V00 LXK2-PM12-R00, LXK2-PM12-S00, LXK2-PM14-U00 LXK2-PE12-Q00, LXK2-PE12-R00, LXK2-PE12-S00, LXK2-PE14-T00, LXK2-PE14-U00 LXK2-PB12-K00, LXK2-PB12-L00, LXK2-PB12-M00, LXK2-PB14-N00, LXK2-PB14-P00, LXK2-PB14-Q00 LXK2-PR12-L00, LXK2-PR12-M00, LXK2-PR14-Q00, LXK2-PR14-R00 LXK2-PD12-Q00, LXK2-PD12-R00, LXK2-PD12-S00 LXK2-PH12-R00, LXK2-PH12-S00 LXK2-PL12-P00, LXK2-PL12-Q00, LXK2-PL12-R00 Source: www.luxeon.com KINGBRIGHT: KA-3528ASYC Source: www.kingbright.com
Q1 Q10 = crystal:CRYSTAL: CRYSTAL; OC_FARNELL: 1667008; OC_NEWARK: unknown
R1-R17 R19-R158 = resistor:R-EU_: RESISTOR, European symbol
R18 = pot:TRIM_EU-: POTENTIOMETER
SV1 = con-ml:ML64: HARTING; OC_FARNELL: unknown; OC_NEWARK: unknown
U$1 = 0-xythobuz:KLINKENBUCHSE: 3.5mm Klinkenbuchse, print. CL and CR are connected to left and right respectively, when no 3,5mm Klinkenstecker is inserted. If a stecker is plugged in, they have no connection.
U$2-U$65 = 0-xythobuz:PNP
U$66-U$73 = 0-xythobuz:IRF530
U$74 = 0-xythobuz:TASTER
X1 = con-conrad:73398?: FEMALE PRINT CONNECTOR Niedervolt-Steckverbinder Distributor Conrad
X2 = 1_USER:USB-B-MINI-SMD